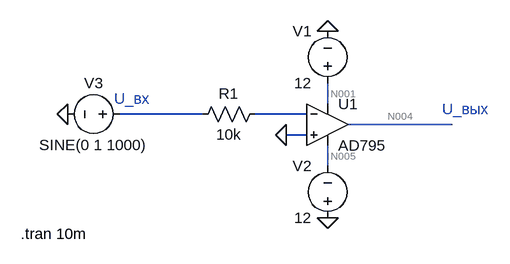
[diagram p0: schematic task1.asc]
task1.asc, the LTspice schematic file:
Version 4.1
SHEET 1 880 680
WIRE 208 144 208 112
WIRE 16 160 -112 160
WIRE 176 160 96 160
WIRE 400 176 240 176
WIRE 176 192 144 192
WIRE 208 240 208 208
FLAG 208 320 0
FLAG 208 32 0
FLAG -192 160 0
FLAG 144 192 0
SYMBOL OpAmps\\AD795 208 112 R0
SYMATTR InstName U1
SYMBOL res 112 144 R90
WINDOW 0 0 56 VBottom 2
WINDOW 3 32 56 VTop 2
SYMATTR InstName R1
SYMATTR Value 10k
SYMBOL voltage 208 336 R180
WINDOW 0 24 96 Left 2
WINDOW 3 24 16 Left 2
SYMATTR InstName V2
SYMATTR Value 12
SYMBOL voltage 208 128 R180
WINDOW 0 24 96 Left 2
WINDOW 3 24 16 Left 2
SYMATTR InstName V1
SYMATTR Value 12
SYMBOL voltage -96 160 R90
WINDOW 0 -32 56 VBottom 2
WINDOW 3 32 56 VTop 2
WINDOW 123 0 0 Left 0
WINDOW 39 0 0 Left 0
SYMATTR InstName V3
SYMATTR Value SINE(0 1 1000)
TEXT 384 152 Left 2 ;U_вых
TEXT -120 136 Left 2 ;U_вх
TEXT -264 344 Left 2 !.tran 10m

The netlist it stands for:
* task1.asc
X§U1 0 N003 N001 N005 N004 AD795  ; pins In+ In- V+ V- OUT
R1 N003 N002 10k
V2 0 N005 12
V1 N001 0 12
V3 N002 0 SINE(0 1 1000)
* U_вых
* U_вх
.tran 10m
.lib ADI1.lib
.backanno
.end

* Results of the author's LTspice run, read from the files saved beside the schematic
* Operating Point, zero values left out:
*   V(n001) = 12 V
*   V(n005) = -12 V
*   I(V1) = -1.226 mA
*   I(V2) = -1.226 mA
*   Ix(u1:3) = 1.226 mA
*   Ix(u1:4) = -1.226 mA
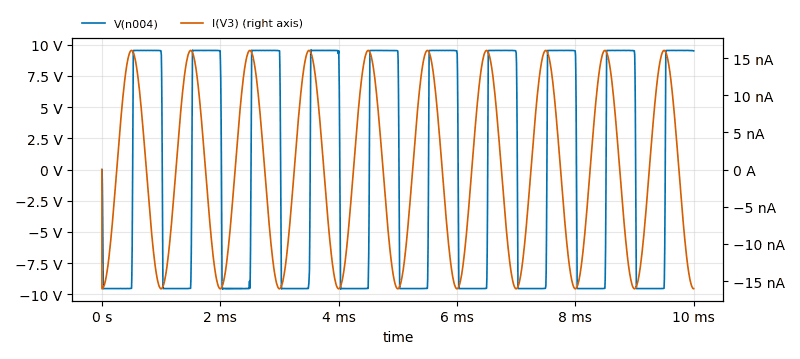
[diagram p1: Transient Analysis of task1.asc, plotted from the saved traces]
* Transient Analysis, 1 run:
*   V(n004): min -9.551 V, max 9.547 V, average 1.186 mV, rms 9.389 V, last 9.507 V
*   I(V3): min -16.03 nA, max 16.03 nA, average 41.88 fA, rms 11.33 nA, last -16.02 nA